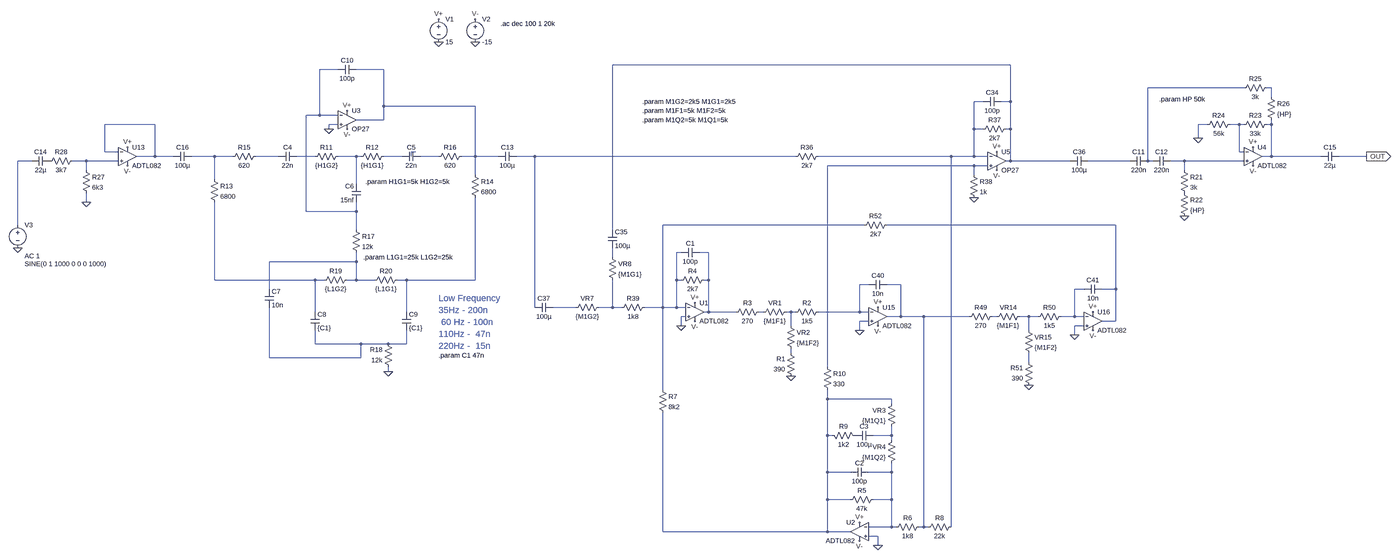
[diagram p0: schematic nyan_eq.asc, whole sheet]
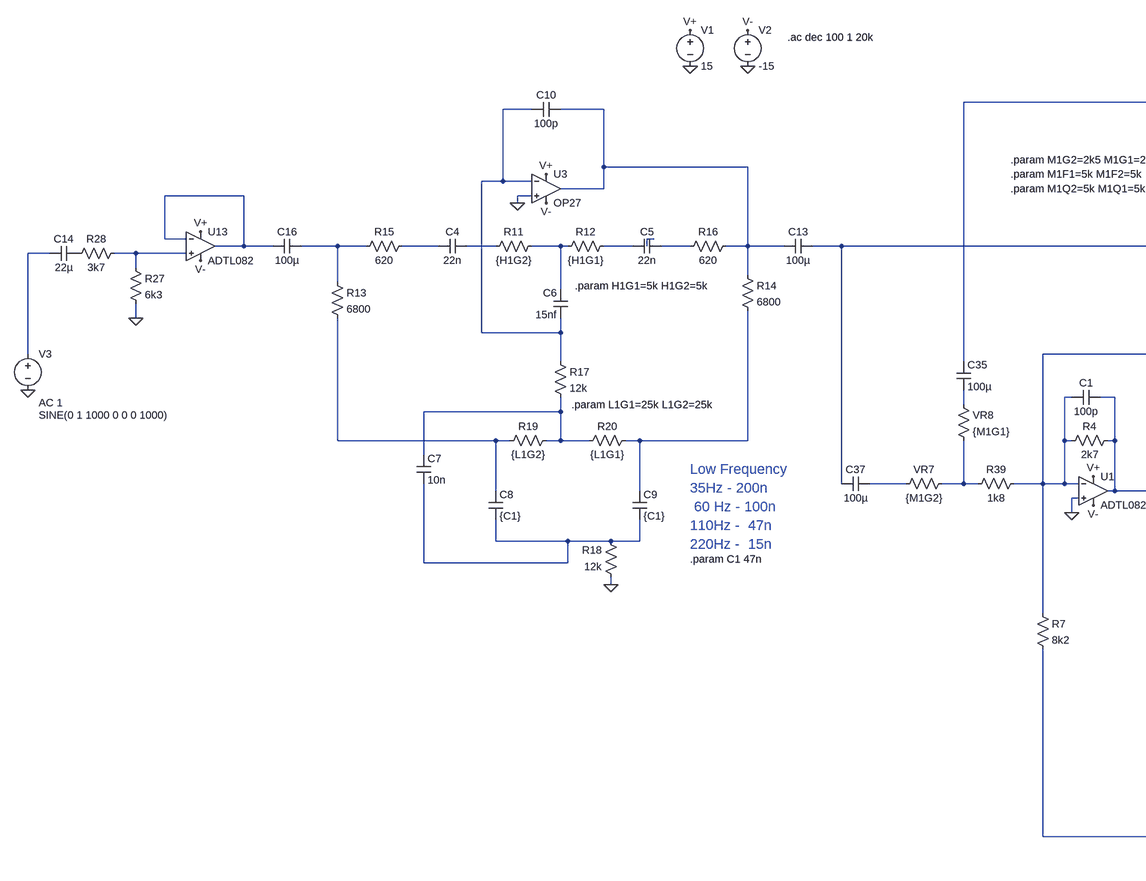
[diagram p1: schematic nyan_eq.asc, part, row 1 of 1, column 1 of 2]
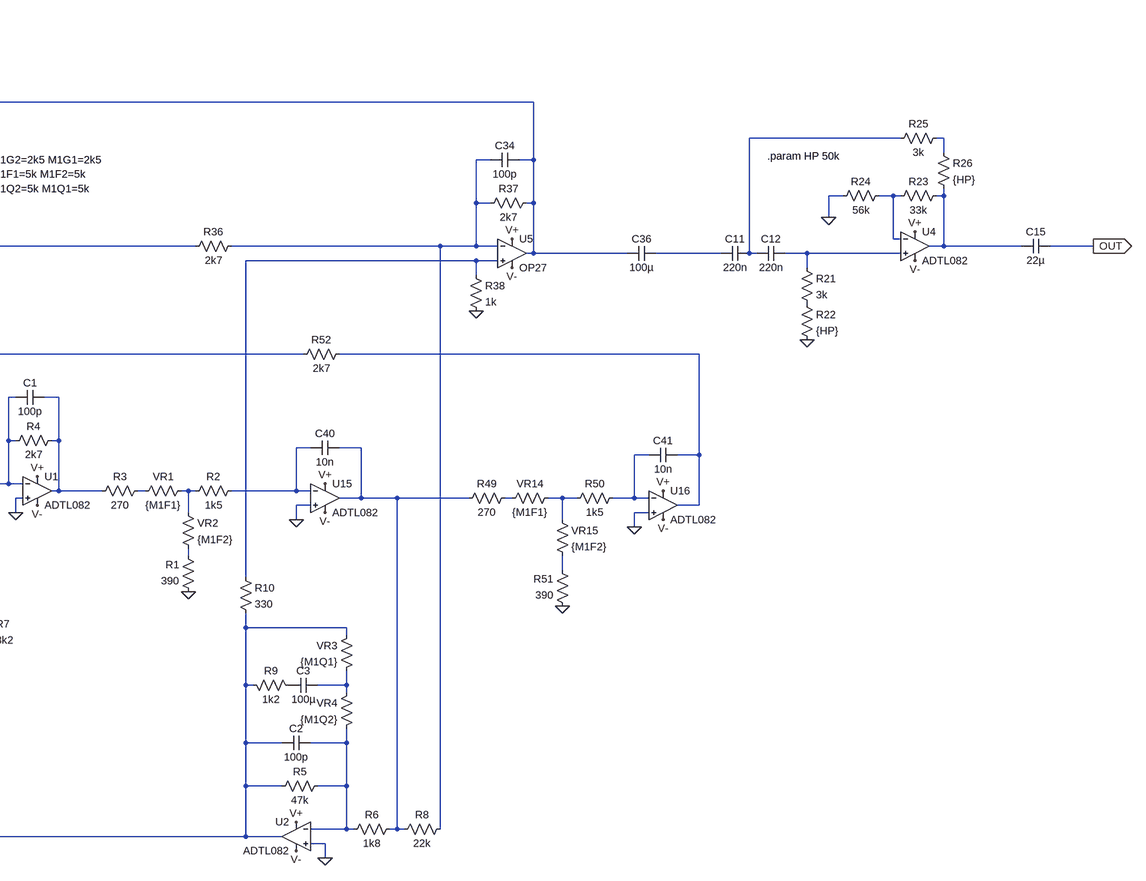
[diagram p2: schematic nyan_eq.asc, part, row 1 of 1, column 2 of 2]
nyan_eq.asc, the LTspice schematic file:
Version 4
SHEET 1 2500 4376
WIRE -1824 0 -3216 0
WIRE -4176 16 -4240 16
WIRE -4016 16 -4112 16
WIRE -1008 80 -1344 80
WIRE -912 80 -928 80
WIRE -912 112 -912 80
WIRE -1920 128 -1952 128
WIRE -1824 128 -1824 0
WIRE -1824 128 -1856 128
WIRE -4016 144 -4016 16
WIRE -3696 144 -4016 144
WIRE -4240 176 -4240 16
WIRE -4240 176 -4288 176
WIRE -4176 176 -4240 176
WIRE -4016 192 -4016 144
WIRE -4016 192 -4112 192
WIRE -4816 208 -4992 208
WIRE -4176 208 -4208 208
WIRE -1136 208 -1168 208
WIRE -1024 208 -1056 208
WIRE -1008 208 -1024 208
WIRE -912 208 -912 192
WIRE -912 208 -928 208
WIRE -4208 224 -4208 208
WIRE -1952 224 -1952 128
WIRE -1920 224 -1952 224
WIRE -1824 224 -1824 128
WIRE -1824 224 -1840 224
WIRE -1168 256 -1168 208
WIRE -4992 304 -4992 208
WIRE -4944 304 -4992 304
WIRE -3904 304 -3920 304
WIRE -1024 304 -1024 208
WIRE -1008 304 -1024 304
WIRE -4816 320 -4816 208
WIRE -4816 320 -4880 320
WIRE -4752 320 -4816 320
WIRE -4608 320 -4688 320
WIRE -4544 320 -4608 320
WIRE -4384 320 -4464 320
WIRE -4256 320 -4320 320
WIRE -4112 320 -4176 320
WIRE -4096 320 -4112 320
WIRE -3952 320 -4016 320
WIRE -3920 320 -3920 304
WIRE -3824 320 -3888 320
WIRE -3696 320 -3696 144
WIRE -3696 320 -3744 320
WIRE -3616 320 -3696 320
WIRE -3488 320 -3552 320
WIRE -2576 320 -3488 320
WIRE -2032 320 -2496 320
WIRE -1952 320 -1952 224
WIRE -1952 320 -2032 320
WIRE -1904 320 -1952 320
WIRE -912 320 -912 208
WIRE -912 320 -944 320
WIRE -704 320 -912 320
WIRE -544 320 -640 320
WIRE -5248 336 -5296 336
WIRE -5056 336 -5104 336
WIRE -4944 336 -5056 336
WIRE -1824 336 -1824 224
WIRE -1824 336 -1840 336
WIRE -1616 336 -1824 336
WIRE -1408 336 -1552 336
WIRE -1344 336 -1344 80
WIRE -1328 336 -1344 336
WIRE -1216 336 -1264 336
WIRE -1008 336 -1216 336
WIRE -1952 352 -2464 352
WIRE -1904 352 -1952 352
WIRE -5056 368 -5056 336
WIRE -1216 368 -1216 336
WIRE -3696 384 -3696 320
WIRE -1952 384 -1952 352
WIRE -4608 400 -4608 320
WIRE -4112 416 -4112 320
WIRE -5056 480 -5056 448
WIRE -4288 512 -4288 176
WIRE -4112 512 -4112 480
WIRE -4112 512 -4288 512
WIRE -5296 560 -5296 336
WIRE -2336 560 -3040 560
WIRE -1456 560 -2256 560
WIRE -4112 576 -4112 512
WIRE -3216 576 -3216 0
WIRE -2976 656 -2992 656
WIRE -2880 656 -2912 656
WIRE -3216 672 -3216 640
WIRE -4112 688 -4112 656
WIRE -4112 688 -4416 688
WIRE -4608 752 -4608 480
WIRE -4256 752 -4608 752
WIRE -4224 752 -4256 752
WIRE -4112 752 -4112 688
WIRE -4112 752 -4144 752
WIRE -4048 752 -4112 752
WIRE -3936 752 -3968 752
WIRE -3696 752 -3696 464
WIRE -3696 752 -3936 752
WIRE -2992 752 -2992 656
WIRE -2976 752 -2992 752
WIRE -2880 752 -2880 656
WIRE -2880 752 -2896 752
WIRE -2320 768 -2352 768
WIRE -2208 768 -2256 768
WIRE -4416 784 -4416 688
WIRE -1568 784 -1600 784
WIRE -1456 784 -1456 560
WIRE -1456 784 -1504 784
WIRE -3488 848 -3488 320
WIRE -3344 848 -3424 848
WIRE -3216 848 -3216 752
WIRE -3216 848 -3264 848
WIRE -3184 848 -3216 848
WIRE -3040 848 -3040 560
WIRE -3040 848 -3104 848
WIRE -2992 848 -2992 752
WIRE -2992 848 -3040 848
WIRE -2960 848 -2992 848
WIRE -4256 864 -4256 752
WIRE -3936 864 -3936 752
WIRE -2880 864 -2880 752
WIRE -2880 864 -2896 864
WIRE -2784 864 -2880 864
WIRE -2688 864 -2704 864
WIRE -2592 864 -2608 864
WIRE -2576 864 -2592 864
WIRE -2352 864 -2352 768
WIRE -2352 864 -2496 864
WIRE -2320 864 -2352 864
WIRE -2960 880 -2976 880
WIRE -2208 880 -2208 768
WIRE -2208 880 -2256 880
WIRE -2128 880 -2208 880
WIRE -1968 880 -2128 880
WIRE -1872 880 -1888 880
WIRE -1760 880 -1792 880
WIRE -1728 880 -1760 880
WIRE -1600 880 -1600 784
WIRE -1600 880 -1648 880
WIRE -1568 880 -1600 880
WIRE -2320 896 -2352 896
WIRE -1456 896 -1456 784
WIRE -1456 896 -1504 896
WIRE -2976 912 -2976 880
WIRE -2592 912 -2592 864
WIRE -1568 912 -1600 912
WIRE -2352 928 -2352 896
WIRE -1760 928 -1760 880
WIRE -1600 944 -1600 912
WIRE -4256 976 -4256 928
WIRE -4096 976 -4256 976
WIRE -4000 976 -4096 976
WIRE -3936 976 -3936 928
WIRE -3936 976 -4000 976
WIRE -2592 1008 -2592 992
WIRE -4416 1024 -4416 848
WIRE -4096 1024 -4096 976
WIRE -4096 1024 -4416 1024
WIRE -1760 1040 -1760 1008
WIRE -2464 1056 -2464 352
WIRE -4000 1072 -4000 1056
WIRE -3040 1136 -3040 848
WIRE -2464 1168 -2464 1136
WIRE -2240 1168 -2464 1168
WIRE -2240 1184 -2240 1168
WIRE -2464 1296 -2464 1168
WIRE -2448 1296 -2464 1296
WIRE -2240 1296 -2240 1264
WIRE -2240 1296 -2304 1296
WIRE -2240 1312 -2240 1296
WIRE -2464 1424 -2464 1296
WIRE -2384 1424 -2464 1424
WIRE -2240 1424 -2240 1392
WIRE -2240 1424 -2320 1424
WIRE -2464 1520 -2464 1424
WIRE -2384 1520 -2464 1520
WIRE -2240 1520 -2240 1424
WIRE -2240 1520 -2304 1520
WIRE -2240 1616 -2240 1520
WIRE -2240 1616 -2320 1616
WIRE -2224 1616 -2240 1616
WIRE -2128 1616 -2128 880
WIRE -2128 1616 -2144 1616
WIRE -2112 1616 -2128 1616
WIRE -2032 1616 -2032 320
WIRE -3040 1632 -3040 1216
WIRE -2464 1632 -2464 1520
WIRE -2464 1632 -3040 1632
WIRE -2384 1632 -2464 1632
WIRE -2288 1648 -2320 1648
WIRE -2288 1680 -2288 1648
FLAG -3824 -80 0
FLAG -3824 -160 V+
FLAG -3696 -80 0
FLAG -3696 -160 V-
FLAG -5296 640 0
FLAG -1872 304 V+
FLAG -1872 368 V-
FLAG -1952 464 0
FLAG -2288 848 V+
FLAG -2288 912 V-
FLAG -1536 864 V+
FLAG -1536 928 V-
FLAG -1600 944 0
FLAG -2352 928 0
FLAG -1760 1120 0
FLAG -2928 832 V+
FLAG -2928 896 V-
FLAG -2976 912 0
FLAG -2592 1088 0
FLAG -2352 1600 V+
FLAG -2352 1664 V-
FLAG -2288 1680 0
FLAG -4208 224 0
FLAG -4144 160 V+
FLAG -4144 224 V-
FLAG -4000 1072 0
FLAG -976 288 V+
FLAG -976 352 V-
FLAG -1216 528 0
FLAG -544 320 OUT
IOPIN -544 320 Out
FLAG -1168 256 0
FLAG -4912 288 V+
FLAG -4912 352 V-
FLAG -5056 480 0
SYMBOL voltage -3824 -176 R0
WINDOW 123 0 0 Left 0
WINDOW 39 0 0 Left 0
SYMATTR InstName V1
SYMATTR Value 15
SYMBOL voltage -3696 -176 R0
WINDOW 123 0 0 Left 0
WINDOW 39 0 0 Left 0
SYMATTR InstName V2
SYMATTR Value -15
SYMBOL voltage -5296 544 R0
WINDOW 3 24 152 Left 2
WINDOW 123 24 124 Left 2
WINDOW 39 0 0 Left 0
SYMATTR Value SINE(0 1 1000 0 0 0 1000)
SYMATTR Value2 AC 1
SYMATTR InstName V3
SYMBOL Opamps\\ADTL082 -4912 256 R0
SYMATTR InstName U13
SYMBOL res -1824 208 R90
WINDOW 0 0 56 VBottom 2
WINDOW 3 32 56 VTop 2
SYMATTR InstName R37
SYMATTR Value 2k7
SYMBOL cap -1856 112 R90
WINDOW 0 0 32 VBottom 2
WINDOW 3 32 32 VTop 2
SYMATTR InstName C34
SYMATTR Value 100p
SYMBOL cap -1552 320 R90
WINDOW 0 0 32 VBottom 2
WINDOW 3 32 32 VTop 2
SYMATTR InstName C36
SYMATTR Value 100µ
SYMBOL res -2480 304 R90
WINDOW 0 0 56 VBottom 2
WINDOW 3 32 56 VTop 2
SYMATTR InstName R36
SYMATTR Value 2k7
SYMBOL res -3248 832 R90
WINDOW 0 0 56 VBottom 2
WINDOW 3 32 56 VTop 2
SYMATTR InstName VR7
SYMATTR Value {M1G2}
SYMBOL res -3232 656 R0
SYMATTR InstName VR8
SYMATTR Value {M1G1}
SYMBOL cap -3424 832 R90
WINDOW 0 0 32 VBottom 2
WINDOW 3 32 32 VTop 2
SYMATTR InstName C37
SYMATTR Value 100µ
SYMBOL cap -3232 576 R0
SYMATTR InstName C35
SYMATTR Value 100µ
SYMBOL res -3088 832 R90
WINDOW 0 0 56 VBottom 2
WINDOW 3 32 56 VTop 2
SYMATTR InstName R39
SYMATTR Value 1k8
SYMBOL res -1968 368 R0
SYMATTR InstName R38
SYMATTR Value 1k
SYMBOL Opamps\\ADTL082 -2288 816 R0
SYMATTR InstName U15
SYMBOL cap -2256 752 R90
WINDOW 0 0 32 VBottom 2
WINDOW 3 32 32 VTop 2
SYMATTR InstName C40
SYMATTR Value 10n
SYMBOL res -1872 864 R90
WINDOW 0 0 56 VBottom 2
WINDOW 3 32 56 VTop 2
SYMATTR InstName R49
SYMATTR Value 270
SYMBOL res -1632 864 R90
WINDOW 0 0 56 VBottom 2
WINDOW 3 32 56 VTop 2
SYMATTR InstName R50
SYMATTR Value 1k5
SYMBOL res -1744 1136 R180
WINDOW 0 36 76 Left 2
WINDOW 3 36 40 Left 2
SYMATTR InstName R51
SYMATTR Value 390
SYMBOL Opamps\\ADTL082 -1536 832 R0
SYMATTR InstName U16
SYMBOL cap -1504 768 R90
WINDOW 0 0 32 VBottom 2
WINDOW 3 32 32 VTop 2
SYMATTR InstName C41
SYMATTR Value 10n
SYMBOL res -2240 544 R90
WINDOW 0 0 56 VBottom 2
WINDOW 3 32 56 VTop 2
SYMATTR InstName R52
SYMATTR Value 2k7
SYMBOL res -1776 864 R90
WINDOW 0 0 56 VBottom 2
WINDOW 3 32 56 VTop 2
SYMATTR InstName VR14
SYMATTR Value {M1F1}
SYMBOL res -1776 912 R0
SYMATTR InstName VR15
SYMATTR Value {M1F2}
SYMBOL res -2576 1104 R180
WINDOW 0 36 76 Left 2
WINDOW 3 36 40 Left 2
SYMATTR InstName R1
SYMATTR Value 390
SYMBOL res -2480 848 R90
WINDOW 0 0 56 VBottom 2
WINDOW 3 32 56 VTop 2
SYMATTR InstName R2
SYMATTR Value 1k5
SYMBOL res -2688 848 R90
WINDOW 0 0 56 VBottom 2
WINDOW 3 32 56 VTop 2
SYMATTR InstName R3
SYMATTR Value 270
SYMBOL res -2592 848 R90
WINDOW 0 0 56 VBottom 2
WINDOW 3 32 56 VTop 2
SYMATTR InstName VR1
SYMATTR Value {M1F1}
SYMBOL res -2608 896 R0
SYMATTR InstName VR2
SYMATTR Value {M1F2}
SYMBOL Opamps\\ADTL082 -2928 800 R0
SYMATTR InstName U1
SYMBOL res -2880 736 R90
WINDOW 0 0 56 VBottom 2
WINDOW 3 32 56 VTop 2
SYMATTR InstName R4
SYMATTR Value 2k7
SYMBOL cap -2912 640 R90
WINDOW 0 0 32 VBottom 2
WINDOW 3 32 32 VTop 2
SYMATTR InstName C1
SYMATTR Value 100p
SYMBOL Opamps\\ADTL082 -2352 1568 M0
SYMATTR InstName U2
SYMBOL res -2288 1504 R90
WINDOW 0 0 56 VBottom 2
WINDOW 3 32 56 VTop 2
SYMATTR InstName R5
SYMATTR Value 47k
SYMBOL cap -2320 1408 R90
WINDOW 0 0 32 VBottom 2
WINDOW 3 32 32 VTop 2
SYMATTR InstName C2
SYMATTR Value 100p
SYMBOL res -2128 1600 R90
WINDOW 0 0 56 VBottom 2
WINDOW 3 32 56 VTop 2
SYMATTR InstName R6
SYMATTR Value 1k8
SYMBOL res -3056 1120 R0
SYMATTR InstName R7
SYMATTR Value 8k2
SYMBOL res -2016 1600 R90
WINDOW 0 0 56 VBottom 2
WINDOW 3 32 56 VTop 2
SYMATTR InstName R8
SYMATTR Value 22k
SYMBOL res -2224 1168 M0
SYMATTR InstName VR3
SYMATTR Value {M1Q1}
SYMBOL res -2224 1296 M0
SYMATTR InstName VR4
SYMATTR Value {M1Q2}
SYMBOL cap -2368 1280 M90
WINDOW 0 0 32 VBottom 2
WINDOW 3 32 32 VTop 2
SYMATTR InstName C3
SYMATTR Value 100µ
SYMBOL res -2464 1280 M90
WINDOW 0 0 56 VBottom 2
WINDOW 3 32 56 VTop 2
SYMATTR InstName R9
SYMATTR Value 1k2
SYMBOL res -2480 1040 R0
SYMATTR InstName R10
SYMATTR Value 330
SYMBOL res -4160 304 R90
WINDOW 0 0 56 VBottom 2
WINDOW 3 32 56 VTop 2
SYMATTR InstName R11
SYMATTR Value {H1G2}
SYMBOL res -4000 304 R90
WINDOW 0 0 56 VBottom 2
WINDOW 3 32 56 VTop 2
SYMATTR InstName R12
SYMATTR Value {H1G1}
SYMBOL cap -4320 304 R90
WINDOW 0 0 32 VBottom 2
WINDOW 3 32 32 VTop 2
SYMATTR InstName C4
SYMATTR Value 22n
SYMBOL cap -3888 304 R90
WINDOW 0 0 32 VBottom 2
WINDOW 3 32 32 VTop 2
SYMATTR InstName C5
SYMATTR Value 22n
SYMBOL cap -4096 480 R180
WINDOW 0 24 56 Left 2
WINDOW 3 24 8 Left 2
SYMATTR InstName C6
SYMATTR Value 15nf
SYMBOL res -4624 384 R0
SYMATTR InstName R13
SYMATTR Value 6800
SYMATTR SpiceLine tol=1 pwr=0.25
SYMBOL res -3712 368 R0
SYMATTR InstName R14
SYMATTR Value 6800
SYMBOL res -4448 304 R90
WINDOW 0 0 56 VBottom 2
WINDOW 3 32 56 VTop 2
SYMATTR InstName R15
SYMATTR Value 620
SYMBOL res -3728 304 R90
WINDOW 0 0 56 VBottom 2
WINDOW 3 32 56 VTop 2
SYMATTR InstName R16
SYMATTR Value 620
SYMBOL res -4128 560 R0
SYMATTR InstName R17
SYMATTR Value 12k
SYMBOL res -3984 1072 R180
WINDOW 0 36 76 Left 2
WINDOW 3 36 40 Left 2
SYMATTR InstName R18
SYMATTR Value 12k
SYMBOL cap -4432 784 R0
SYMATTR InstName C7
SYMATTR Value 10n
SYMBOL res -4128 736 R90
WINDOW 0 0 56 VBottom 2
WINDOW 3 32 56 VTop 2
SYMATTR InstName R19
SYMATTR Value {L1G2}
SYMBOL res -3952 736 R90
WINDOW 0 0 56 VBottom 2
WINDOW 3 32 56 VTop 2
SYMATTR InstName R20
SYMATTR Value {L1G1}
SYMBOL cap -4272 864 R0
SYMATTR InstName C8
SYMATTR Value {C1}
SYMBOL cap -3952 864 R0
SYMATTR InstName C9
SYMATTR Value {C1}
SYMBOL OpAmps\\OP27 -4144 128 R0
SYMATTR InstName U3
SYMBOL cap -4112 0 R90
WINDOW 0 0 32 VBottom 2
WINDOW 3 32 32 VTop 2
SYMATTR InstName C10
SYMATTR Value 100p
SYMBOL Opamps\\ADTL082 -976 256 R0
SYMATTR InstName U4
SYMBOL cap -1344 320 R90
WINDOW 0 0 32 VBottom 2
WINDOW 3 32 32 VTop 2
SYMATTR InstName C11
SYMATTR Value 220n
SYMBOL cap -1264 320 R90
WINDOW 0 0 32 VBottom 2
WINDOW 3 32 32 VTop 2
SYMATTR InstName C12
SYMATTR Value 220n
SYMBOL res -1232 352 R0
SYMATTR InstName R21
SYMATTR Value 3k
SYMBOL res -1232 432 R0
SYMATTR InstName R22
SYMATTR Value {HP}
SYMBOL res -912 64 R90
WINDOW 0 0 56 VBottom 2
WINDOW 3 32 56 VTop 2
SYMATTR InstName R25
SYMATTR Value 3k
SYMBOL res -928 96 R0
SYMATTR InstName R26
SYMATTR Value {HP}
SYMBOL res -912 192 R90
WINDOW 0 0 56 VBottom 2
WINDOW 3 32 56 VTop 2
SYMATTR InstName R23
SYMATTR Value 33k
SYMBOL res -1040 192 R90
WINDOW 0 0 56 VBottom 2
WINDOW 3 32 56 VTop 2
SYMATTR InstName R24
SYMATTR Value 56k
SYMBOL cap -3552 304 R90
WINDOW 0 0 32 VBottom 2
WINDOW 3 32 32 VTop 2
SYMATTR InstName C13
SYMATTR Value 100µ
SYMBOL cap -640 304 R90
WINDOW 0 0 32 VBottom 2
WINDOW 3 32 32 VTop 2
SYMATTR InstName C15
SYMATTR Value 22µ
SYMBOL OpAmps\\OP27 -1872 272 R0
SYMATTR InstName U5
SYMBOL res -5072 352 R0
SYMATTR InstName R27
SYMATTR Value 6k3
SYMBOL cap -5184 320 R90
WINDOW 0 0 32 VBottom 2
WINDOW 3 32 32 VTop 2
SYMATTR InstName C14
SYMATTR Value 22µ
SYMBOL cap -4688 304 R90
WINDOW 0 0 32 VBottom 2
WINDOW 3 32 32 VTop 2
SYMATTR InstName C16
SYMATTR Value 100µ
SYMBOL res -5088 320 R90
WINDOW 0 0 56 VBottom 2
WINDOW 3 32 56 VTop 2
SYMATTR InstName R28
SYMATTR Value 3k7
TEXT -3608 -144 Left 2 !.ac dec 100 1 20k
TEXT -3112 128 Left 2 !.param M1G2=2k5 M1G1=2k5
TEXT -3112 160 Left 2 !.param M1F1=5k M1F2=5k
TEXT -3112 192 Left 2 !.param M1Q2=5k M1Q1=5k
TEXT -3824 816 Left 3 ;Low Frequency\n35Hz - 200n\n 60 Hz - 100n\n110Hz -  47n\n220Hz -  15n
TEXT -3824 1016 Left 2 !.param C1 47n
TEXT -4088 672 Left 2 !.param L1G1=25k L1G2=25k
TEXT -4080 408 Left 2 !.param H1G1=5k H1G2=5k
TEXT -1304 120 Left 2 !.param HP 50k

The netlist it stands for:
* nyan_eq.asc
V1 V+ 0 15
V2 V- 0 -15
V3 N018 0 SINE(0 1 1000 0 0 0 1000) AC 1
XU13 N019 N007 V+ V- N007 ADTL082  ; pins In+ In- V+ V- OUT
R37 N001 N006 2k7
C34 N001 N006 100p
C36 N020 N001 100µ
R36 N006 N017 2k7
R§VR7 N034 N033 {M1G2}
R§VR8 N026 N034 {M1G1}
C37 N033 N017 100µ
C35 N001 N026 100µ
R39 N023 N034 1k8
R38 N022 0 1k
XU15 0 N030 V+ V- N031 ADTL082  ; pins In+ In- V+ V- OUT
C40 N031 N030 10n
R49 N037 N031 270
R50 N032 N038 1k5
R51 0 N041 390
XU16 0 N032 V+ V- N024 ADTL082  ; pins In+ In- V+ V- OUT
C41 N024 N032 10n
R52 N024 N023 2k7
R§VR14 N038 N037 {M1F1}
R§VR15 N038 N041 {M1F2}
R1 0 N040 390
R2 N030 N036 1k5
R3 N035 N025 270
R§VR1 N036 N035 {M1F1}
R§VR2 N036 N040 {M1F2}
XU1 0 N023 V+ V- N025 ADTL082  ; pins In+ In- V+ V- OUT
R4 N025 N023 2k7
C1 N025 N023 100p
XU2 0 N044 V+ V- N042 ADTL082  ; pins In+ In- V+ V- OUT
R5 N044 N042 47k
C2 N044 N042 100p
R6 N031 N044 1k8
R7 N023 N042 8k2
R8 N006 N031 22k
R§VR3 N042 N043 {M1Q1}
R§VR4 N043 N044 {M1Q2}
C3 P001 N043 100µ
R9 N042 P001 1k2
R10 N022 N042 330
R11 N014 N013 {H1G2}
R12 N015 N014 {H1G1}
C4 N013 N012 22n
C5 N016 N015 22n
C6 N002 N014 15nf
R13 N011 N028 6800 tol=1 pwr=0.25
R14 N003 N029 6800
R15 N012 N011 620
R16 N003 N016 620
R17 N002 N027 12k
R18 0 N039 12k
C7 N027 N039 10n
R19 N027 N028 {L1G2}
R20 N029 N027 {L1G1}
C8 N028 N039 {C1}
C9 N029 N039 {C1}
XU3 0 N002 V+ V- N003 OP27  ; pins In+ In- V+ V- OUT
C10 N003 N002 100p
XU4 N021 N008 V+ V- N009 ADTL082  ; pins In+ In- V+ V- OUT
C11 N004 N020 220n
C12 N021 N004 220n
R21 N021 P002 3k
R22 P002 0 {HP}
R25 N005 N004 3k
R26 N005 N009 {HP}
R23 N009 N008 33k
R24 N008 0 56k
C13 N017 N003 100µ
C15 OUT N009 22µ
XU5 N022 N006 V+ V- N001 OP27  ; pins In+ In- V+ V- OUT
R27 N019 0 6k3
C14 P003 N018 22µ
C16 N011 N007 100µ
R28 N019 P003 3k7
.ac dec 100 1 20k
.param M1G2=2k5 M1G1=2k5
.param M1F1=5k M1F2=5k
.param M1Q2=5k M1Q1=5k
* Low Frequency
* 35Hz - 200n
*  60 Hz - 100n
* 110Hz -  47n
* 220Hz -  15n
.param C1 47n
.param L1G1=25k L1G2=25k
.param H1G1=5k H1G2=5k
.param HP 50k
.lib ADI.lib
.backanno
.end